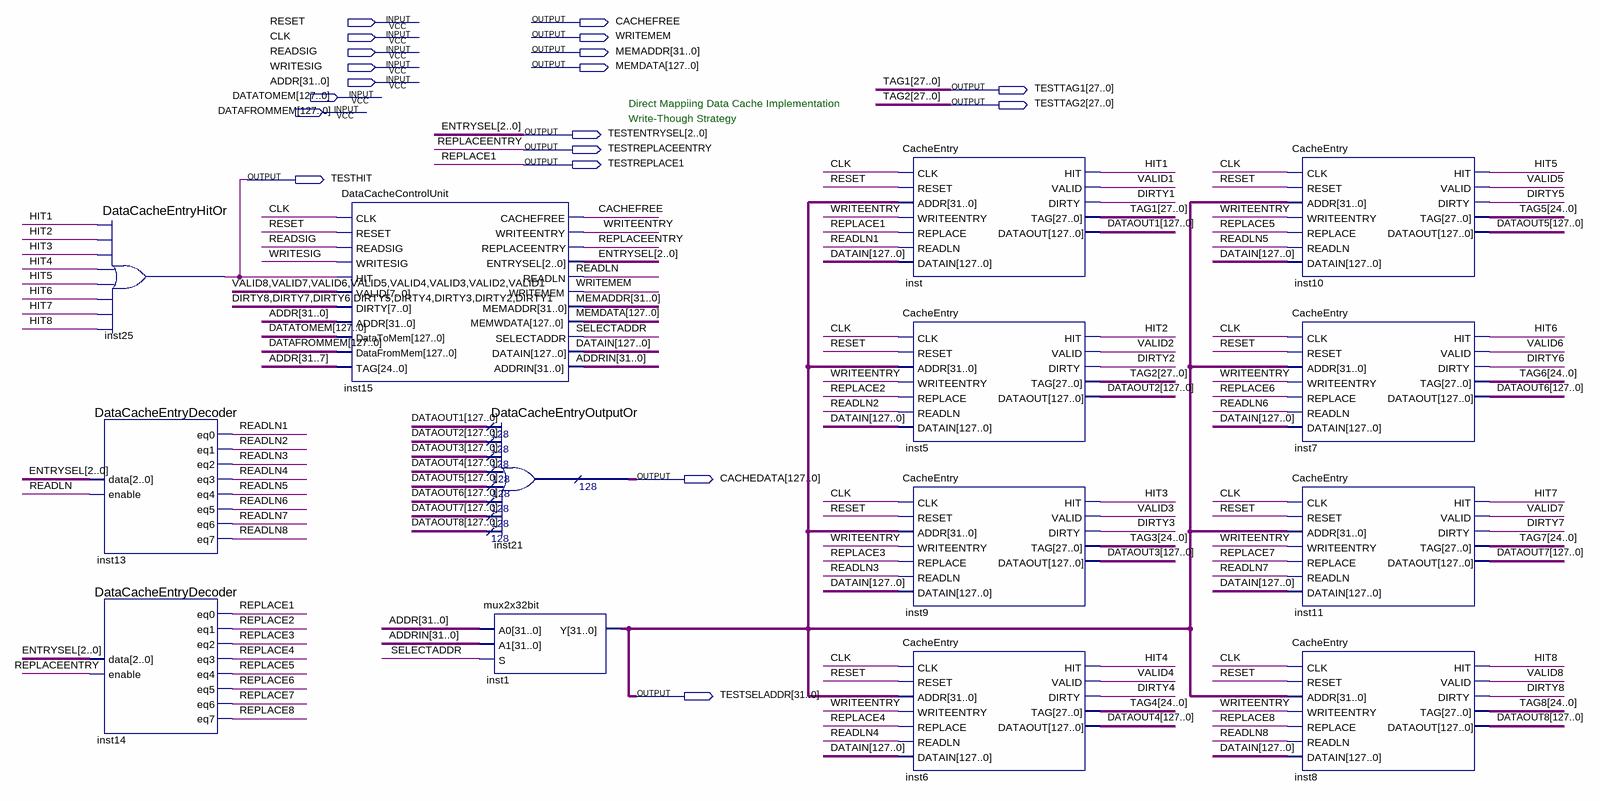
[diagram p0: schematic sheet]
// Quartus schematic DataCache.bdf as structural Verilog: 14 symbols, 19 pins
module DataCache (
  input  RESET,
  input  CLK,
  input  READSIG,
  input  WRITESIG,
  input  [31:0] ADDR,
  input  [127:0] DATATOMEM,
  input  [127:0] DATAFROMMEM,
  output CACHEFREE,
  output WRITEMEM,
  output [31:0] MEMADDR,
  output [127:0] MEMDATA,
  output [27:0] TESTTAG1,
  output [27:0] TESTTAG2,
  output [2:0] TESTENTRYSEL,
  output TESTREPLACEENTRY,
  output TESTREPLACE1,
  output TESTHIT,
  output [127:0] CACHEDATA,
  output [31:0] TESTSELADDR
);

  wire DIRTY1, DIRTY2, DIRTY3, DIRTY4, DIRTY5, DIRTY6, DIRTY7, DIRTY8, HIT1, HIT2, HIT3, HIT4, HIT5, HIT6,
       HIT7, HIT8, READLN, READLN1, READLN2, READLN3, READLN4, READLN5, READLN6, READLN7, READLN8, REPLACE2,
       REPLACE3, REPLACE4, REPLACE5, REPLACE6, REPLACE7, REPLACE8, SELECTADDR, VALID1, VALID2, VALID3,
       VALID4, VALID5, VALID6, VALID7, VALID8, WRITEENTRY;
  wire [24:0] TAG3, TAG4, TAG5, TAG6, TAG7, TAG8;
  wire [31:0] ADDRIN;
  wire [127:0] DATAIN, DATAOUT1, DATAOUT2, DATAOUT3, DATAOUT4, DATAOUT5, DATAOUT6, DATAOUT7, DATAOUT8;

  DataCacheEntryHitOr inst25 (
    .data0(HIT1), .data1(HIT2), .data2(HIT3), .data3(HIT4), .data4(HIT5), .data5(HIT6), .data6(HIT7),
    .data7(HIT8), .result(TESTHIT));
  DataCacheEntryDecoder inst13 (
    .data(TESTENTRYSEL), .enable(READLN), .eq0(READLN1), .eq1(READLN2), .eq2(READLN3), .eq3(READLN4),
    .eq4(READLN5), .eq5(READLN6), .eq6(READLN7), .eq7(READLN8));
  DataCacheEntryDecoder inst14 (
    .data(TESTENTRYSEL), .enable(TESTREPLACEENTRY), .eq0(TESTREPLACE1), .eq1(REPLACE2), .eq2(REPLACE3),
    .eq3(REPLACE4), .eq4(REPLACE5), .eq5(REPLACE6), .eq6(REPLACE7), .eq7(REPLACE8));
  DataCacheControlUnit inst15 (
    .CLK(CLK), .RESET(RESET), .READSIG(READSIG), .WRITESIG(WRITESIG), .HIT(TESTHIT),
    .VALID({VALID8, VALID7, VALID6, VALID5, VALID4, VALID3, VALID2, VALID1}),
    .DIRTY({DIRTY8, DIRTY7, DIRTY6, DIRTY5, DIRTY4, DIRTY3, DIRTY2, DIRTY1}), .ADDR(ADDR),
    .DataToMem(DATATOMEM), .DataFromMem(DATAFROMMEM), .TAG(ADDR[31:7]), .CACHEFREE(CACHEFREE),
    .WRITEENTRY(WRITEENTRY), .REPLACEENTRY(TESTREPLACEENTRY), .ENTRYSEL(TESTENTRYSEL), .READLN(READLN),
    .WRITEMEM(WRITEMEM), .MEMADDR(MEMADDR), .MEMWDATA(MEMDATA), .SELECTADDR(SELECTADDR), .DATAIN(DATAIN),
    .ADDRIN(ADDRIN));
  DataCacheEntryOutputOr inst21 (
    .data0x(DATAOUT1), .data1x(DATAOUT2), .data2x(DATAOUT3), .data3x(DATAOUT4), .data4x(DATAOUT5),
    .data5x(DATAOUT6), .data6x(DATAOUT7), .data7x(DATAOUT8), .result(CACHEDATA));
  mux2x32bit inst1 (.A0(ADDR), .A1(ADDRIN), .S(SELECTADDR), .Y(TESTSELADDR));
  CacheEntry inst (
    .CLK(CLK), .RESET(RESET), .ADDR(TESTSELADDR), .WRITEENTRY(WRITEENTRY), .REPLACE(TESTREPLACE1),
    .READLN(READLN1), .DATAIN(DATAIN), .HIT(HIT1), .VALID(VALID1), .DIRTY(DIRTY1), .TAG(TESTTAG1),
    .DATAOUT(DATAOUT1));
  CacheEntry inst5 (
    .CLK(CLK), .RESET(RESET), .ADDR(TESTSELADDR), .WRITEENTRY(WRITEENTRY), .REPLACE(REPLACE2),
    .READLN(READLN2), .DATAIN(DATAIN), .HIT(HIT2), .VALID(VALID2), .DIRTY(DIRTY2), .TAG(TESTTAG2),
    .DATAOUT(DATAOUT2));
  CacheEntry inst9 (
    .CLK(CLK), .RESET(RESET), .ADDR(TESTSELADDR), .WRITEENTRY(WRITEENTRY), .REPLACE(REPLACE3),
    .READLN(READLN3), .DATAIN(DATAIN), .HIT(HIT3), .VALID(VALID3), .DIRTY(DIRTY3), .TAG(TAG3),
    .DATAOUT(DATAOUT3));
  CacheEntry inst6 (
    .CLK(CLK), .RESET(RESET), .ADDR(TESTSELADDR), .WRITEENTRY(WRITEENTRY), .REPLACE(REPLACE4),
    .READLN(READLN4), .DATAIN(DATAIN), .HIT(HIT4), .VALID(VALID4), .DIRTY(DIRTY4), .TAG(TAG4),
    .DATAOUT(DATAOUT4));
  CacheEntry inst10 (
    .CLK(CLK), .RESET(RESET), .ADDR(TESTSELADDR), .WRITEENTRY(WRITEENTRY), .REPLACE(REPLACE5),
    .READLN(READLN5), .DATAIN(DATAIN), .HIT(HIT5), .VALID(VALID5), .DIRTY(DIRTY5), .TAG(TAG5),
    .DATAOUT(DATAOUT5));
  CacheEntry inst7 (
    .CLK(CLK), .RESET(RESET), .ADDR(TESTSELADDR), .WRITEENTRY(WRITEENTRY), .REPLACE(REPLACE6),
    .READLN(READLN6), .DATAIN(DATAIN), .HIT(HIT6), .VALID(VALID6), .DIRTY(DIRTY6), .TAG(TAG6),
    .DATAOUT(DATAOUT6));
  CacheEntry inst11 (
    .CLK(CLK), .RESET(RESET), .ADDR(TESTSELADDR), .WRITEENTRY(WRITEENTRY), .REPLACE(REPLACE7),
    .READLN(READLN7), .DATAIN(DATAIN), .HIT(HIT7), .VALID(VALID7), .DIRTY(DIRTY7), .TAG(TAG7),
    .DATAOUT(DATAOUT7));
  CacheEntry inst8 (
    .CLK(CLK), .RESET(RESET), .ADDR(TESTSELADDR), .WRITEENTRY(WRITEENTRY), .REPLACE(REPLACE8),
    .READLN(READLN8), .DATAIN(DATAIN), .HIT(HIT8), .VALID(VALID8), .DIRTY(DIRTY8), .TAG(TAG8),
    .DATAOUT(DATAOUT8));

  // Other names for the same wires on the sheet: ENTRYSEL[2:0] = TESTENTRYSEL; REPLACE1 = TESTREPLACE1;
  //   REPLACEENTRY = TESTREPLACEENTRY; TAG1[27:0] = TESTTAG1; TAG2[27:0] = TESTTAG2

  // Notes on the sheet:
  //   Direct Mappiing Data Cache Implementation
  //   Write-Though Strategy
endmodule
